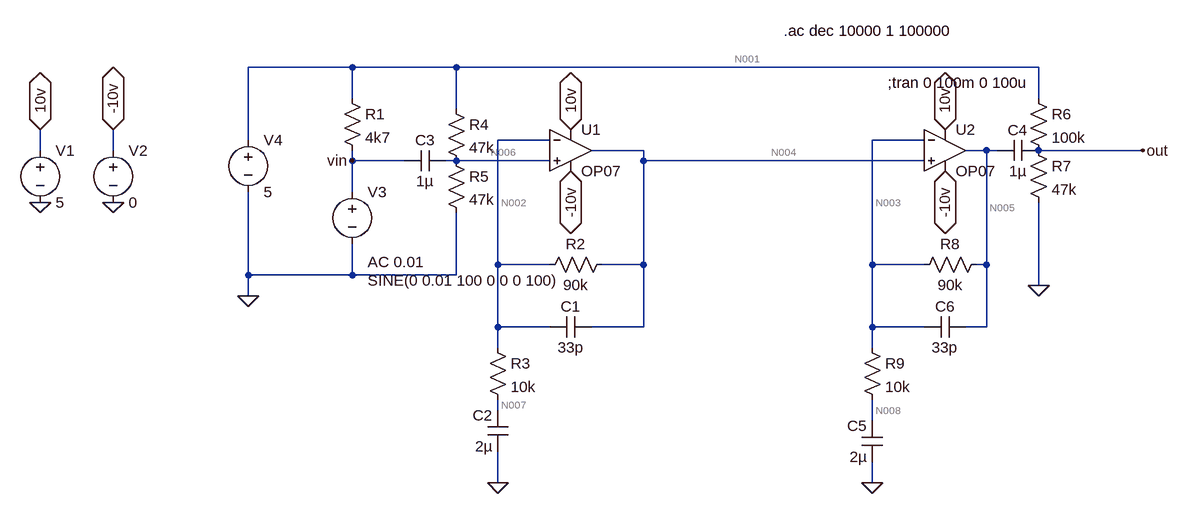
[diagram p0: schematic model.asc]
model.asc, the LTspice schematic file:
Version 4
SHEET 1 1192 708
WIRE -112 48 -272 48
WIRE 48 48 -112 48
WIRE 944 48 48 48
WIRE -112 96 -112 48
WIRE 944 96 944 48
WIRE 48 112 48 48
WIRE -272 160 -272 48
WIRE 192 160 112 160
WIRE 768 160 688 160
WIRE -592 176 -592 144
WIRE -480 176 -480 144
WIRE 336 176 256 176
WIRE 864 176 832 176
WIRE 880 176 864 176
WIRE 1104 176 944 176
WIRE -112 192 -112 176
WIRE -32 192 -112 192
WIRE 48 192 32 192
WIRE 192 192 48 192
WIRE 336 192 336 176
WIRE 768 192 336 192
WIRE -112 240 -112 192
WIRE 112 352 112 160
WIRE 192 352 112 352
WIRE 336 352 336 192
WIRE 336 352 272 352
WIRE 688 352 688 160
WIRE 768 352 688 352
WIRE 864 352 864 176
WIRE 864 352 848 352
WIRE -272 368 -272 240
WIRE -112 368 -112 320
WIRE -112 368 -272 368
WIRE 48 368 48 272
WIRE 48 368 -112 368
WIRE 944 384 944 256
WIRE -272 400 -272 368
WIRE 112 448 112 352
WIRE 192 448 112 448
WIRE 336 448 336 352
WIRE 336 448 256 448
WIRE 688 448 688 352
WIRE 768 448 688 448
WIRE 864 448 864 352
WIRE 864 448 832 448
WIRE 112 480 112 448
WIRE 688 480 688 448
WIRE 112 576 112 560
WIRE 688 592 688 560
WIRE 112 688 112 640
WIRE 688 688 688 656
FLAG -592 256 0
FLAG -480 256 0
FLAG -592 144 10v
IOPIN -592 144 BiDir
FLAG -480 144 -10v
IOPIN -480 144 BiDir
FLAG 224 208 -10v
IOPIN 224 208 BiDir
FLAG 224 144 10v
IOPIN 224 144 BiDir
FLAG 112 688 0
FLAG -272 400 0
FLAG 944 384 0
FLAG 1104 176 out
FLAG 800 208 -10v
IOPIN 800 208 BiDir
FLAG 800 144 10v
IOPIN 800 144 BiDir
FLAG 688 688 0
FLAG -112 192 vin
SYMBOL voltage -592 160 R0
WINDOW 123 0 0 Left 0
WINDOW 39 0 0 Left 0
SYMATTR InstName V1
SYMATTR Value 5
SYMBOL voltage -480 160 R0
WINDOW 123 0 0 Left 0
WINDOW 39 0 0 Left 0
SYMATTR InstName V2
SYMATTR Value 0
SYMBOL res -128 80 R0
SYMATTR InstName R1
SYMATTR Value 4k7
SYMBOL res 288 336 R90
WINDOW 0 0 56 VBottom 2
WINDOW 3 32 56 VTop 2
SYMATTR InstName R2
SYMATTR Value 90k
SYMATTR SpiceLine tol=5
SYMBOL res 96 464 R0
SYMATTR InstName R3
SYMATTR Value 10k
SYMBOL voltage -272 144 R0
WINDOW 123 0 0 Left 0
WINDOW 39 0 0 Left 0
SYMATTR InstName V4
SYMATTR Value 5
SYMBOL cap 32 176 R90
WINDOW 0 0 32 VBottom 2
WINDOW 3 32 32 VTop 2
SYMATTR InstName C3
SYMATTR Value 1µ
SYMBOL res 32 96 R0
SYMATTR InstName R4
SYMATTR Value 47k
SYMBOL res 32 176 R0
SYMATTR InstName R5
SYMATTR Value 47k
SYMBOL res 928 80 R0
SYMATTR InstName R6
SYMATTR Value 100k
SYMBOL res 928 160 R0
SYMATTR InstName R7
SYMATTR Value 47k
SYMBOL cap 944 160 R90
WINDOW 0 0 32 VBottom 2
WINDOW 3 32 32 VTop 2
SYMATTR InstName C4
SYMATTR Value 1µ
SYMBOL cap 256 432 R90
WINDOW 0 0 32 VBottom 2
WINDOW 3 32 32 VTop 2
SYMATTR InstName C1
SYMATTR Value 33p
SYMBOL Opamps\\OP07 224 112 R0
SYMATTR InstName U1
SYMBOL voltage -112 224 R0
WINDOW 3 24 152 Left 2
WINDOW 123 24 124 Left 2
WINDOW 39 0 0 Left 0
SYMATTR Value SINE(0 0.01 100 0 0 0 100)
SYMATTR Value2 AC 0.01
SYMATTR InstName V3
SYMBOL res 864 336 R90
WINDOW 0 0 56 VBottom 2
WINDOW 3 32 56 VTop 2
SYMATTR InstName R8
SYMATTR Value 90k
SYMATTR SpiceLine tol=5
SYMBOL res 672 464 R0
SYMATTR InstName R9
SYMATTR Value 10k
SYMBOL cap 704 656 R180
WINDOW 0 24 56 Left 2
WINDOW 3 24 8 Left 2
SYMATTR InstName C5
SYMATTR Value 2µ
SYMBOL cap 832 432 R90
WINDOW 0 0 32 VBottom 2
WINDOW 3 32 32 VTop 2
SYMATTR InstName C6
SYMATTR Value 33p
SYMBOL Opamps\\OP07 800 112 R0
SYMATTR InstName U2
SYMBOL cap 128 640 R180
WINDOW 0 24 56 Left 2
WINDOW 3 24 8 Left 2
SYMATTR InstName C2
SYMATTR Value 2µ
TEXT 552 -8 Left 2 !.ac dec 10000 1 100000
TEXT 712 72 Left 2 !;tran 0 100m 0 100u

The netlist it stands for:
* model.asc
V1 10v 0 5
V2 -10v 0 0
R1 N001 vin 4k7
R2 N004 N002 90k tol=5
R3 N002 N007 10k
V4 N001 0 5
C3 N006 vin 1µ
R4 N001 N006 47k
R5 N006 0 47k
R6 N001 out 100k
R7 out 0 47k
C4 out N005 1µ
C1 N004 N002 33p
XU1 N006 N002 10v -10v N004 LT1001  ; OP07, pins In+ In- V+ V- OUT
V3 vin 0 SINE(0 0.01 100 0 0 0 100) AC 0.01
R8 N005 N003 90k tol=5
R9 N003 N008 10k
C5 0 N008 2µ
C6 N005 N003 33p
XU2 N004 N003 10v -10v N005 LT1001  ; OP07, pins In+ In- V+ V- OUT
C2 0 N007 2µ
.ac dec 10000 1 100000
;tran 0 100m 0 100u
.lib LTC.lib
.backanno
.end

* Results of the author's LTspice run, read from the files saved beside the schematic
* Operating Point, zero values left out:
*   V(10v) = 5 V
*   V(n001) = 5 V
*   V(n004) = 2.5 V
*   V(n002) = 2.5 V
*   V(n007) = 2.5 V
*   V(n006) = 2.5 V
*   V(out) = 1.599 V
*   V(n005) = 2.5 V
*   V(n003) = 2.5 V
*   V(n008) = 2.5 V
*   I(R7) = 34.01 µA
*   I(R6) = 34.01 µA
*   I(R5) = 53.19 µA
*   I(R4) = 53.19 µA
*   I(R1) = 1.064 mA
*   I(V3) = 1.064 mA
*   I(V4) = -1.151 mA
*   I(V2) = 4.5 mA
*   I(V1) = -4.5 mA
*   Ix(u1:3) = 2.25 mA
*   Ix(u1:4) = -2.25 mA
*   Ix(u2:3) = 2.25 mA
*   Ix(u2:4) = -2.25 mA